# Altium schematic sheet SOCDDR3Bank.SchDoc
size A3; SheetNumber: 15; SheetTotal: 18
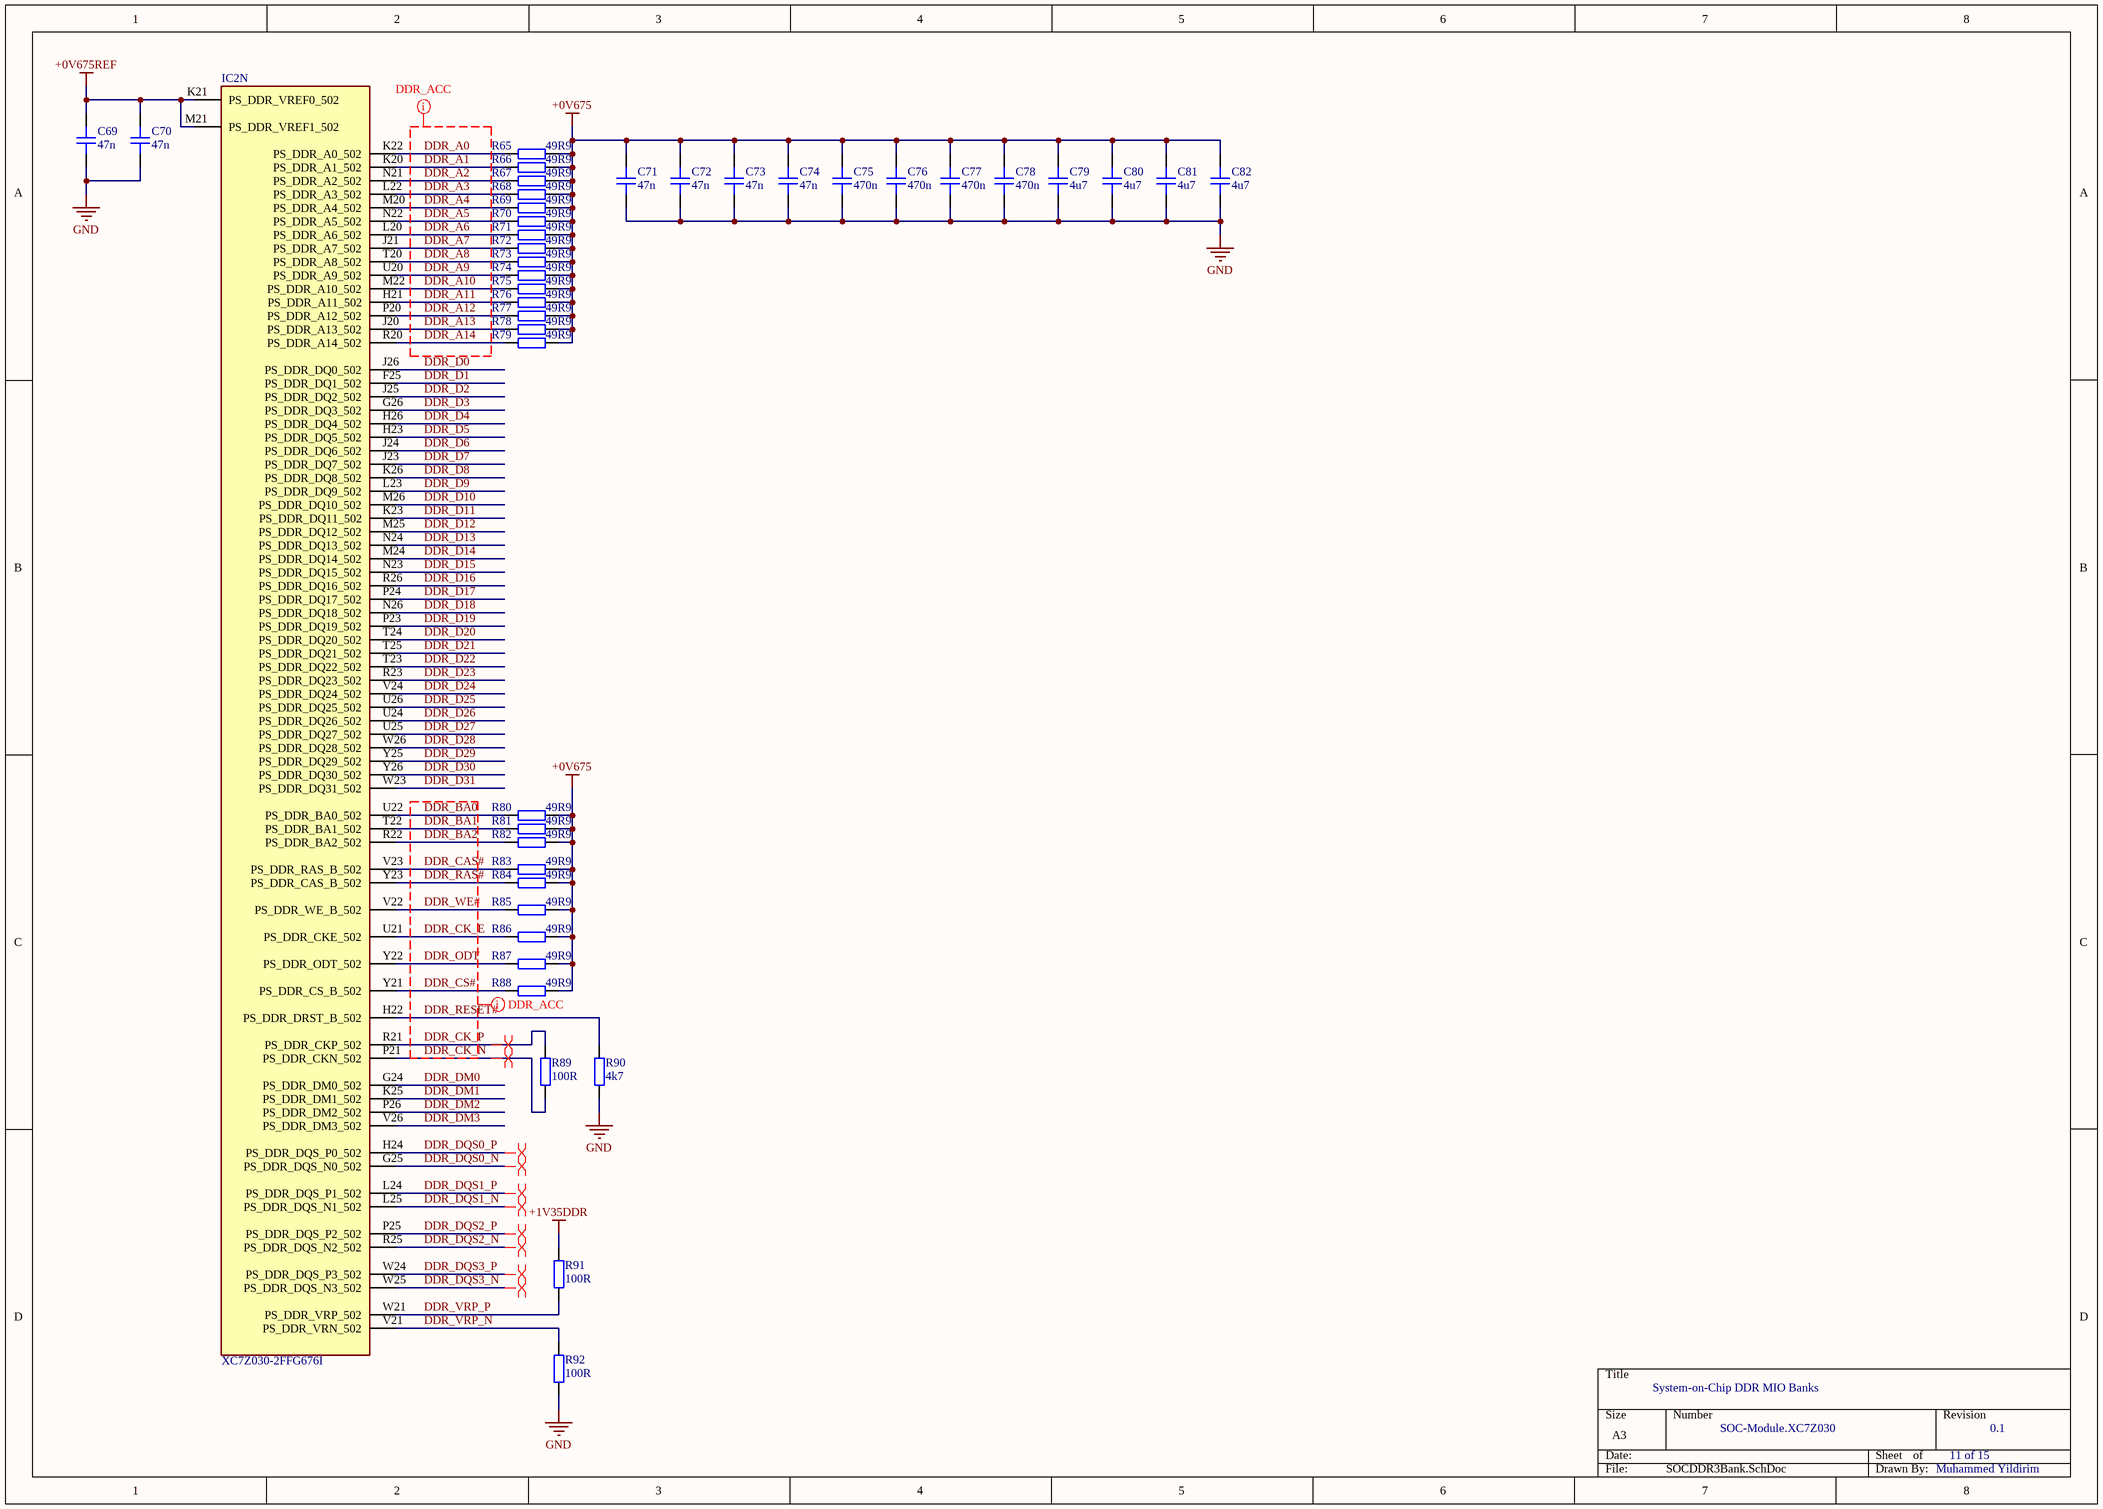
[diagram p0: SOCDDR3Bank.SchDoc]

## Parts
C69  47n  [CAP_0201]
C70  47n  [CAP_0201]
C71  47n  [CAP_0201]
C72  47n  [CAP_0201]
C73  47n  [CAP_0201]
C74  47n  [CAP_0201]
C75  470n  [CAP_0201]
C76  470n  [CAP_0201]
C77  470n  [CAP_0201]
C78  470n  [CAP_0201]
C79  4u7  [CAP_0402]
C80  4u7  [CAP_0402]
C81  4u7  [CAP_0402]
C82  4u7  [CAP_0402]
IC2  XC7Z030-2FFG676I  [BGA676C100P26X26_2700X2700X324]  (part N of 15)
R65  49R9  [RES_0201]
R66  49R9  [RES_0201]
R67  49R9  [RES_0201]
R68  49R9  [RES_0201]
R69  49R9  [RES_0201]
R70  49R9  [RES_0201]
R71  49R9  [RES_0201]
R72  49R9  [RES_0201]
R73  49R9  [RES_0201]
R74  49R9  [RES_0201]
R75  49R9  [RES_0201]
R76  49R9  [RES_0201]
R77  49R9  [RES_0201]
R78  49R9  [RES_0201]
R79  49R9  [RES_0201]
R80  49R9  [RES_0201]
R81  49R9  [RES_0201]
R82  49R9  [RES_0201]
R83  49R9  [RES_0201]
R84  49R9  [RES_0201]
R85  49R9  [RES_0201]
R86  49R9  [RES_0201]
R87  49R9  [RES_0201]
R88  49R9  [RES_0201]
R89  100R  [RES_0201]
R90  4k7  [RES_0201]
R91  100R  [RES_0201]
R92  100R  [RES_0201]

## Nets
+0V675: C71.2 C72.2 C73.2 C74.2 C75.2 C76.2 C77.2 C78.2 C79.2 C80.2 C81.2 C82.2 R65.1 R66.1 R67.1 R68.1 R69.1 R70.1 R71.1 R72.1 R73.1 R74.1 R75.1 R76.1 R77.1 R78.1 R79.1 R80.1 R81.1 R82.1 R83.1 R84.1 R85.1 R86.1 R87.1 R88.1
+0V675REF: C69.2 C70.2 IC2.K21(PS_DDR_VREF0_502) IC2.M21(PS_DDR_VREF1_502)
+1V35DDR: R91.2
GND: C69.1 C70.1 C71.1 C72.1 C73.1 C74.1 C75.1 C76.1 C77.1 C78.1 C79.1 C80.1 C81.1 C82.1 R90.1 R92.1
DDR_A0: IC2.K22(PS_DDR_A0_502) R65.2
DDR_A1: IC2.K20(PS_DDR_A1_502) R66.2
DDR_A2: IC2.N21(PS_DDR_A2_502) R67.2
DDR_A3: IC2.L22(PS_DDR_A3_502) R68.2
DDR_A4: IC2.M20(PS_DDR_A4_502) R69.2
DDR_A5: IC2.N22(PS_DDR_A5_502) R70.2
DDR_A6: IC2.L20(PS_DDR_A6_502) R71.2
DDR_A7: IC2.J21(PS_DDR_A7_502) R72.2
DDR_A8: IC2.T20(PS_DDR_A8_502) R73.2
DDR_A9: IC2.U20(PS_DDR_A9_502) R74.2
DDR_A10: IC2.M22(PS_DDR_A10_502) R75.2
DDR_A11: IC2.H21(PS_DDR_A11_502) R76.2
DDR_A12: IC2.P20(PS_DDR_A12_502) R77.2
DDR_A13: IC2.J20(PS_DDR_A13_502) R78.2
DDR_A14: IC2.R20(PS_DDR_A14_502) R79.2
DDR_BA0: IC2.U22(PS_DDR_BA0_502) R80.2
DDR_BA1: IC2.T22(PS_DDR_BA1_502) R81.2
DDR_BA2: IC2.R22(PS_DDR_BA2_502) R82.2
DDR_CAS#: IC2.V23(PS_DDR_RAS_B_502) R83.2
DDR_CK_E: IC2.U21(PS_DDR_CKE_502) R86.2
DDR_CK_N: IC2.P21(PS_DDR_CKN_502) R89.1
DDR_CK_P: IC2.R21(PS_DDR_CKP_502) R89.2
DDR_CS#: IC2.Y21(PS_DDR_CS_B_502) R88.2
DDR_D0: IC2.J26(PS_DDR_DQ0_502)
DDR_D1: IC2.F25(PS_DDR_DQ1_502)
DDR_D2: IC2.J25(PS_DDR_DQ2_502)
DDR_D3: IC2.G26(PS_DDR_DQ3_502)
DDR_D4: IC2.H26(PS_DDR_DQ4_502)
DDR_D5: IC2.H23(PS_DDR_DQ5_502)
DDR_D6: IC2.J24(PS_DDR_DQ6_502)
DDR_D7: IC2.J23(PS_DDR_DQ7_502)
DDR_D8: IC2.K26(PS_DDR_DQ8_502)
DDR_D9: IC2.L23(PS_DDR_DQ9_502)
DDR_D10: IC2.M26(PS_DDR_DQ10_502)
DDR_D11: IC2.K23(PS_DDR_DQ11_502)
DDR_D12: IC2.M25(PS_DDR_DQ12_502)
DDR_D13: IC2.N24(PS_DDR_DQ13_502)
DDR_D14: IC2.M24(PS_DDR_DQ14_502)
DDR_D15: IC2.N23(PS_DDR_DQ15_502)
DDR_D16: IC2.R26(PS_DDR_DQ16_502)
DDR_D17: IC2.P24(PS_DDR_DQ17_502)
DDR_D18: IC2.N26(PS_DDR_DQ18_502)
DDR_D19: IC2.P23(PS_DDR_DQ19_502)
DDR_D20: IC2.T24(PS_DDR_DQ20_502)
DDR_D21: IC2.T25(PS_DDR_DQ21_502)
DDR_D22: IC2.T23(PS_DDR_DQ22_502)
DDR_D23: IC2.R23(PS_DDR_DQ23_502)
DDR_D24: IC2.V24(PS_DDR_DQ24_502)
DDR_D25: IC2.U26(PS_DDR_DQ25_502)
DDR_D26: IC2.U24(PS_DDR_DQ26_502)
DDR_D27: IC2.U25(PS_DDR_DQ27_502)
DDR_D28: IC2.W26(PS_DDR_DQ28_502)
DDR_D29: IC2.Y25(PS_DDR_DQ29_502)
DDR_D30: IC2.Y26(PS_DDR_DQ30_502)
DDR_D31: IC2.W23(PS_DDR_DQ31_502)
DDR_DM0: IC2.G24(PS_DDR_DM0_502)
DDR_DM1: IC2.K25(PS_DDR_DM1_502)
DDR_DM2: IC2.P26(PS_DDR_DM2_502)
DDR_DM3: IC2.V26(PS_DDR_DM3_502)
DDR_DQS0_N: IC2.G25(PS_DDR_DQS_N0_502)
DDR_DQS0_P: IC2.H24(PS_DDR_DQS_P0_502)
DDR_DQS1_N: IC2.L25(PS_DDR_DQS_N1_502)
DDR_DQS1_P: IC2.L24(PS_DDR_DQS_P1_502)
DDR_DQS2_N: IC2.R25(PS_DDR_DQS_N2_502)
DDR_DQS2_P: IC2.P25(PS_DDR_DQS_P2_502)
DDR_DQS3_N: IC2.W25(PS_DDR_DQS_N3_502)
DDR_DQS3_P: IC2.W24(PS_DDR_DQS_P3_502)
DDR_ODT: IC2.Y22(PS_DDR_ODT_502) R87.2
DDR_RAS#: IC2.Y23(PS_DDR_CAS_B_502) R84.2
DDR_RESET#: IC2.H22(PS_DDR_DRST_B_502) R90.2
DDR_VRP_N: IC2.V21(PS_DDR_VRN_502) R92.2
DDR_VRP_P: IC2.W21(PS_DDR_VRP_502) R91.1
DDR_WE#: IC2.V22(PS_DDR_WE_B_502) R85.2

## Layout directives
differential pair: DDR_CK_N, DDR_CK_P, DDR_DQS0_N, DDR_DQS0_P, DDR_DQS1_N, DDR_DQS1_P, DDR_DQS2_N, DDR_DQS2_P, DDR_DQS3_N, DDR_DQS3_P
mark named DDR_ACC: DDR_A0, DDR_A1, DDR_A2, DDR_A3, DDR_A4, DDR_A5, DDR_A6, DDR_A7, DDR_A8, DDR_A9, DDR_A10, DDR_A11, DDR_A12, DDR_A13, DDR_A14, DDR_BA0, DDR_BA1, DDR_BA2, DDR_CAS#, DDR_CK_E, DDR_CK_N, DDR_CK_P, DDR_CS#, DDR_ODT, DDR_RAS#, DDR_RESET#, DDR_WE#

## Notes on the sheet
- System-on-Chip DDR MIO Banks
- SOC-Module.XC7Z030
- 11 of 15
- 0.1
- Muhammed Yildirim

## Library data of the parts
C69-C78 = CAP_0201: Capacitor SMD 0201; Manufacturer: *; Manufacturer Part Number: *; Distributor Link: *; LCSC: *; Rating: *; Dielectric: *
C79-C82 = CAP_0402: Capacitor SMD 0402; Manufacturer: *; Manufacturer Part Number: *; Distributor Link: *; LCSC: *; Rating: *; Dielectric: *
IC2 = XC7Z030-2FFG676I: Integrated Circuit; Manufacturer_Name: AMD; Datasheet Link: http://www.xilinx.com/support/documentation/data_sheets/ds190-Zynq-7000-Overview.pdf; Height: 3.24mm; Manufacturer_Part_Number: XC7Z030-2FFG676I; Mouser Part Number: 217-XC7Z030-2FFG676I; Mouser Price/Stock: https://www.mouser.co.uk/ProductDetail/Xilinx/XC7Z030-2FFG676I?qs=rrS6PyfT74cuZK5O3CSpmw%3D%3D
R65-R92 = RES_0201: Resistor SMD 0201; Manufacturer: *; Manufacturer Part Number: *; Distributor Link: *; LCSC: *